# Altium schematic sheet Interface Pinboard.SchDoc: main_assy PCB
size A4
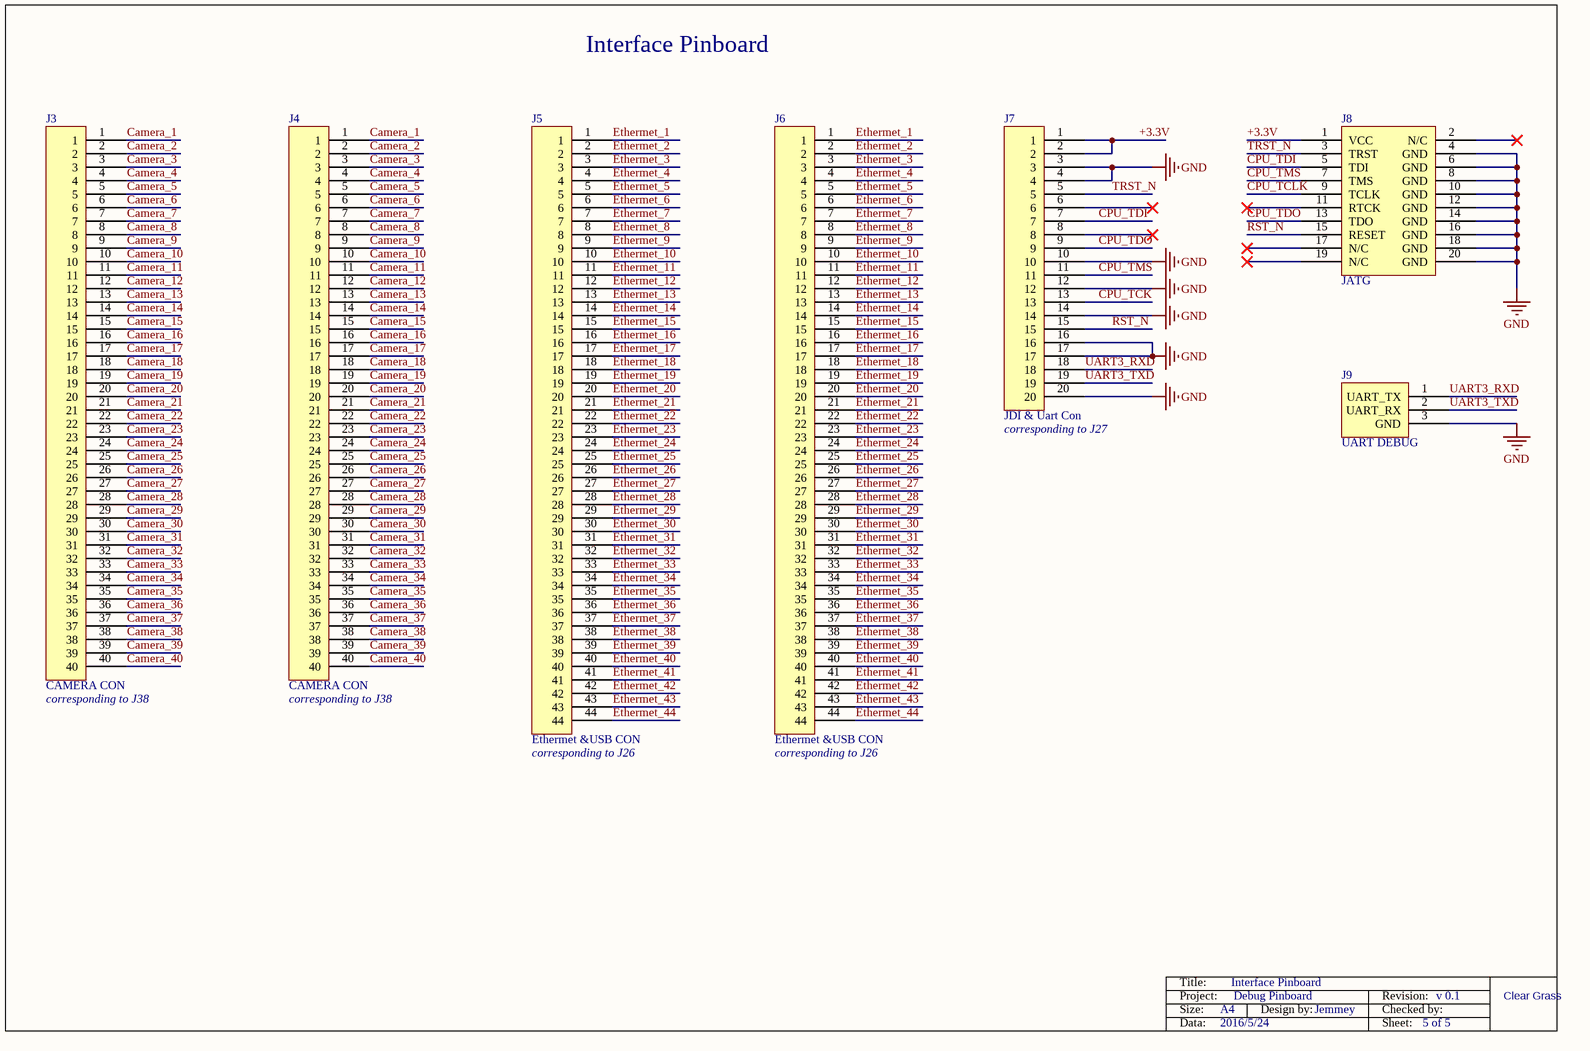
[diagram p0: Interface Pinboard.SchDoc]

## Parts
J3  CAMERA CON
J4  CAMERA CON
J5  Ethermet &USB CON
J6  Ethermet &USB CON
J7  JDI & Uart Con
J8  JATG
J9  UART DEBUG

## Nets
GND: J7.3 J7.4 J7.10 J7.12 J7.14 J7.16 J7.17 J7.20 J8.4(GND) J8.6(GND) J8.8(GND) J8.10(GND) J8.12(GND) J8.14(GND) J8.16(GND) J8.18(GND) J8.20(GND) J9.3(GND)
+3.3V: J7.1 J7.2 J8.1(VCC)
Camera_1: J3.1 J4.1
Camera_2: J3.2 J4.2
Camera_3: J3.3 J4.3
Camera_4: J3.4 J4.4
Camera_5: J3.5 J4.5
Camera_6: J3.6 J4.6
Camera_7: J3.7 J4.7
Camera_8: J3.8 J4.8
Camera_9: J3.9 J4.9
Camera_10: J3.10 J4.10
Camera_11: J3.11 J4.11
Camera_12: J3.12 J4.12
Camera_13: J3.13 J4.13
Camera_14: J3.14 J4.14
Camera_15: J3.15 J4.15
Camera_16: J3.16 J4.16
Camera_17: J3.17 J4.17
Camera_18: J3.18 J4.18
Camera_19: J3.19 J4.19
Camera_20: J3.20 J4.20
Camera_21: J3.21 J4.21
Camera_22: J3.22 J4.22
Camera_23: J3.23 J4.23
Camera_24: J3.24 J4.24
Camera_25: J3.25 J4.25
Camera_26: J3.26 J4.26
Camera_27: J3.27 J4.27
Camera_28: J3.28 J4.28
Camera_29: J3.29 J4.29
Camera_30: J3.30 J4.30
Camera_31: J3.31 J4.31
Camera_32: J3.32 J4.32
Camera_33: J3.33 J4.33
Camera_34: J3.34 J4.34
Camera_35: J3.35 J4.35
Camera_36: J3.36 J4.36
Camera_37: J3.37 J4.37
Camera_38: J3.38 J4.38
Camera_39: J3.39 J4.39
Camera_40: J3.40 J4.40
CPU_TCK: J7.13
CPU_TCLK: J8.9(TCLK)
CPU_TDI: J7.7 J8.5(TDI)
CPU_TDO: J7.9 J8.13(TDO)
CPU_TMS: J7.11 J8.7(TMS)
Ethermet_1: J5.1 J6.1
Ethermet_2: J5.2 J6.2
Ethermet_3: J5.3 J6.3
Ethermet_4: J5.4 J6.4
Ethermet_5: J5.5 J6.5
Ethermet_6: J5.6 J6.6
Ethermet_7: J5.7 J6.7
Ethermet_8: J5.8 J6.8
Ethermet_9: J5.9 J6.9
Ethermet_10: J5.10 J6.10
Ethermet_11: J5.11 J6.11
Ethermet_12: J5.12 J6.12
Ethermet_13: J5.13 J6.13
Ethermet_14: J5.14 J6.14
Ethermet_15: J5.15 J6.15
Ethermet_16: J5.16 J6.16
Ethermet_17: J5.17 J6.17
Ethermet_18: J5.18 J6.18
Ethermet_19: J5.19 J6.19
Ethermet_20: J5.20 J6.20
Ethermet_21: J5.21 J6.21
Ethermet_2~{2}: J5.22 J6.22
Ethermet_23: J5.23 J6.23
Ethermet_24: J5.24 J6.24
Ethermet_25: J5.25 J6.25
Ethermet_26: J5.26 J6.26
Ethermet_27: J5.27 J6.27
Ethermet_28: J5.28 J6.28
Ethermet_29: J5.29 J6.29
Ethermet_30: J5.30 J6.30
Ethermet_31: J5.31 J6.31
Ethermet_32: J5.32 J6.32
Ethermet_33: J5.33 J6.33
Ethermet_34: J5.34 J6.34
Ethermet_35: J5.35 J6.35
Ethermet_36: J5.36 J6.36
Ethermet_37: J5.37 J6.37
Ethermet_38: J5.38 J6.38
Ethermet_39: J5.39 J6.39
Ethermet_40: J5.40 J6.40
Ethermet_41: J5.41 J6.41
Ethermet_42: J5.42 J6.42
Ethermet_43: J5.43 J6.43
Ethermet_44: J5.44 J6.44
RST_N: J7.15 J8.15(RESET)
TRST_N: J7.5 J8.3(TRST)
UART3_RXD: J7.18 J9.1(UART_TX)
UART3_TXD: J7.19 J9.2(UART_RX)

Not connected (* = marked no-connect by the designer): J7 6* 8*; J8 2(N/C)* 11(RTCK)* 17(N/C)* 19(N/C)*

## Notes on the sheet
- Interface Pinboard
- (near J7) corresponding to J27
- (near J3) corresponding to J38
- (near J4) corresponding to J38
- (near J5) corresponding to J26
- (near J6) corresponding to J26
- Title:
- Project:
- Size:
- Data:
- A4
- 2016/5/24
- Debug Pinboard
- Design by:
- Jemmey
- Revision:
- Sheet:
- Checked by:
- 5 of 5
- v 0.1
- Clear Grass

## Library data of the parts
J9 = CON